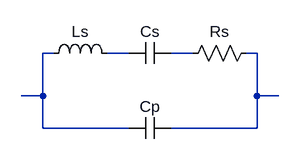
[diagram p0: schematic esqXtal.asc]
esqXtal.asc, the LTspice schematic file:
Version 4
SHEET 1 880 680
WIRE -32 112 -48 112
WIRE 80 112 48 112
WIRE 176 112 144 112
WIRE 272 112 256 112
WIRE -48 176 -48 112
WIRE -48 176 -80 176
WIRE 272 176 272 112
WIRE 304 176 272 176
WIRE -48 224 -48 176
WIRE 80 224 -48 224
WIRE 272 224 272 176
WIRE 272 224 144 224
SYMBOL res 160 128 R270
WINDOW 0 32 56 VTop 2
WINDOW 3 0 56 VBottom 2
SYMATTR InstName Rs
SYMATTR Value ""
SYMBOL cap 80 128 R270
WINDOW 0 32 32 VTop 2
WINDOW 3 0 32 VBottom 2
SYMATTR InstName Cs
SYMATTR Value ""
SYMBOL cap 80 240 R270
WINDOW 0 32 32 VTop 2
WINDOW 3 0 32 VBottom 2
SYMATTR InstName Cp
SYMATTR Value ""
SYMBOL ind -48 128 R270
WINDOW 0 32 56 VTop 2
WINDOW 3 5 56 VBottom 2
SYMATTR InstName Ls
SYMATTR Value ""

The netlist it stands for:
* esqXtal.asc
Rs N003 N004
Cs N002 N003
Cp N001 N004
Ls N001 N002
.backanno
.end